# EasyEDA Pro project 轮足机器人主板&核心板.epro, schematic 主板原理图
Board Name: 主板; Create Date: 2024-11-16; Page Name: P1; Project Name: 轮足机器人; Schematic Name: 主板原理图; Update Date: 2024-11-25; Company: 嘉立创EDA; Drawed: YienMaster; Page Size: A4; Version: V1.0
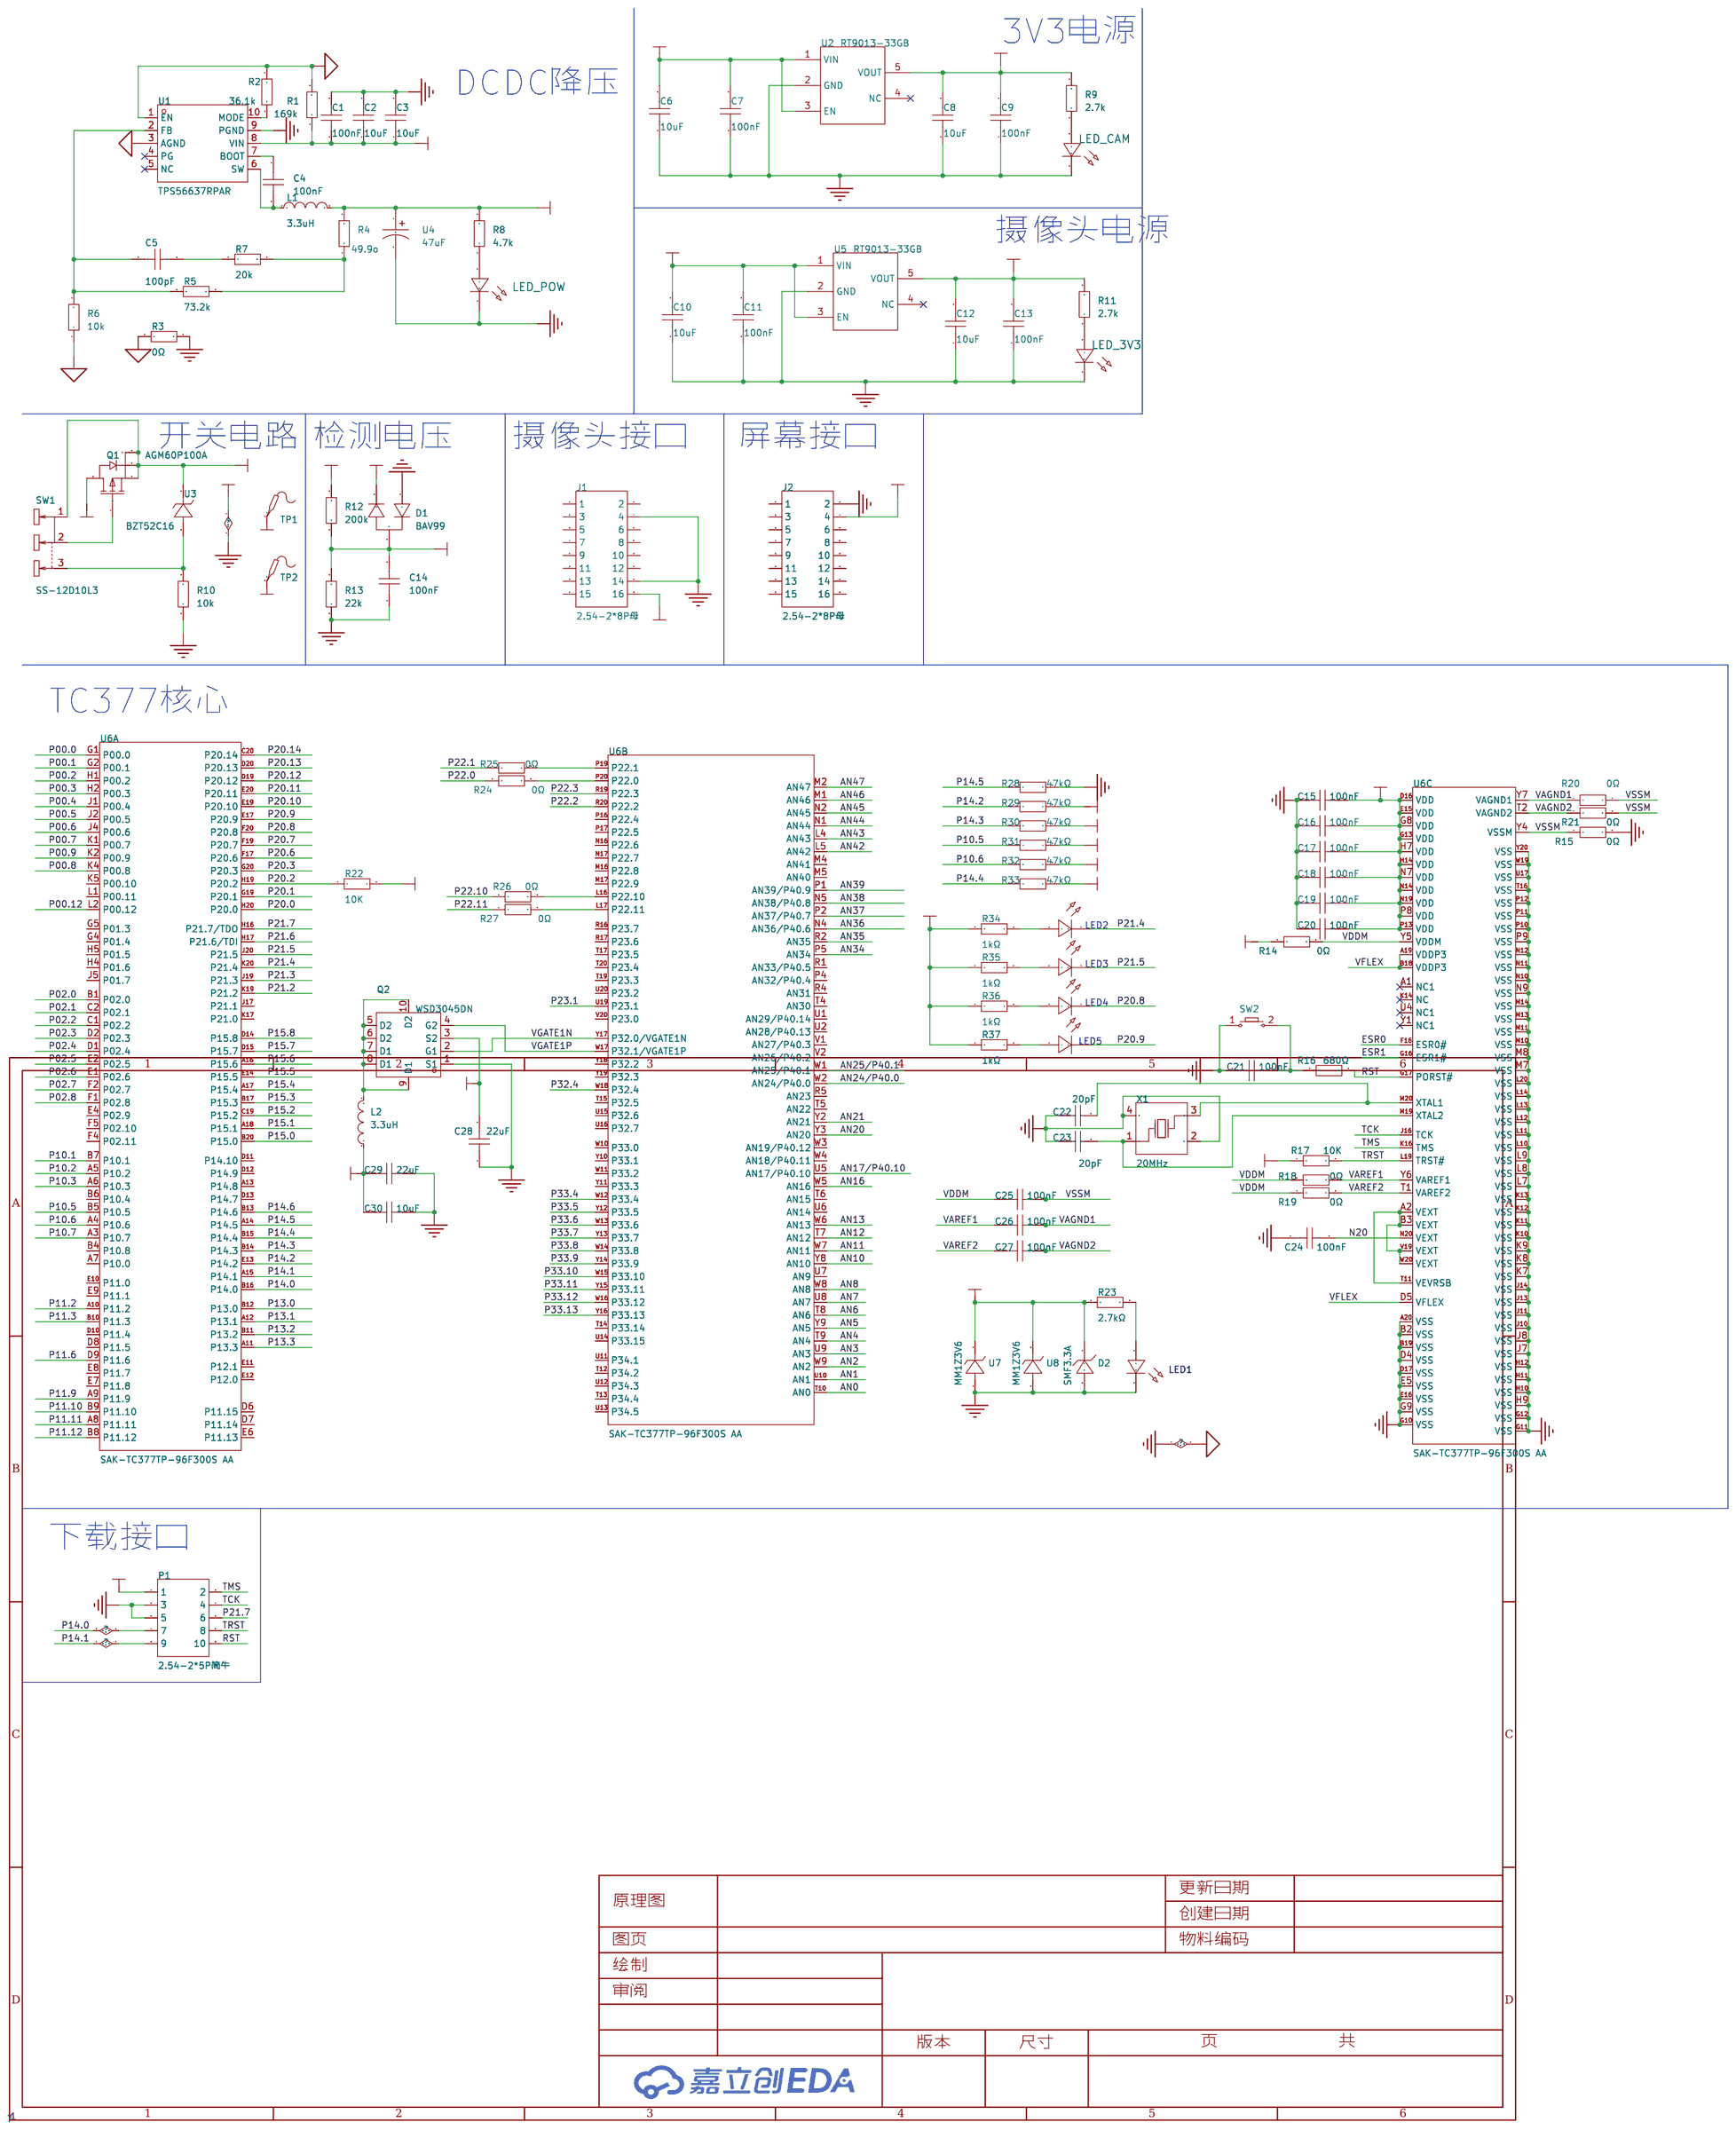
[diagram p1: schematic sheet]

## Parts
C1  100nF  [C0603]
C2  10uF  [C1206]
C3  10uF  [C1206]
C4  100nF  [C0603]
C5  100pF  [C0603]
C6  10uF  [C1206]
C7  100nF  [C0603]
C8  10uF  [C1206]
C9  100nF  [C0603]
C10  10uF  [C1206]
C11  100nF  [C0603]
C12  10uF  [C1206]
C13  100nF  [C0603]
C14  100nF  [C0603]
C15  100nF  [C0603]
C16  100nF  [C0603]
C17  100nF  [C0603]
C18  100nF  [C0603]
C19  100nF  [C0603]
C20  100nF  [C0603]
C21  100nF  [C0603]
C22  20pF  [C0603]
C23  20pF  [C0603]
C24  100nF  [C0603]
C25  100nF  [C0603]
C26  100nF  [C0603]
C27  100nF  [C0603]
C28  22uF  [C0603]
C29  22uF  [C0603]
C30  10uF  [C1206]
D1  BAV99  [SOT-23_L2.9-W1.3-P1.90-LS2.4-BR]
D2  SMF3.3A  [SOD-123_L2.8-W1.8-LS3.7-RD]
J1  2.54-2*8P母  [HDR-TH_16P-P2.54-V-F-R2-C8-S2.54]
J2  2.54-2*8P母  [HDR-TH_16P-P2.54-V-F-R2-C8-S2.54]
L1  3.3uH  [IND-SMD_L7.0-W6.6]
L2  3.3uH  [IND-SMD_L4.4-W4.2-A]
LED1  -  [LED_0603]
LED2  -  [LED_0603]
LED3  -  [LED_0603]
LED4  -  [LED_0603]
LED5  -  [LED_0603]
LED_3V3  -  [LED_0603]
LED_CAM  -  [LED_0603]
LED_POW  -  [LED_0603]
P1  2.54-2*5P简牛  [IDC-TH_10P-P2.54_C5665]
Q1  AGM60P100A  [TDSON-8_L5.9-W5.2-P1.27-BL]
Q2  WSD3045DN  [DFN-8_L3.2-W3.2-P0.65-LS3.4-BL-EP]
R1  169k  [R0603]
R2  36.1k  [R0603]
R3  0Ω  [R0603]
R4  49.9o  [R0603]
R5  73.2k  [R0603]
R6  10k  [R0603]
R7  20k  [R0603]
R8  4.7k  [R0603]
R9  2.7k  [R0603]
R10  10k  [R0603]
R11  2.7k  [R0603]
R12  200k  [R0603]
R13  22k  [R0603]
R14  0Ω  [R0603]
R15  0Ω  [R0603]
R16  680Ω  [R0603]
R17  10K  [R0603]
R18  0Ω  [R0603]
R19  0Ω  [R0603]
R20  0Ω  [R0603]
R21  0Ω  [R0603]
R22  10K  [R0603]
R23  2.7kΩ  [R0603]
R24  0Ω  [R0603]
R25  0Ω  [R0603]
R26  0Ω  [R0603]
R27  0Ω  [R0603]
R28  47kΩ  [R0603]
R29  47kΩ  [R0603]
R30  47kΩ  [R0603]
R31  47kΩ  [R0603]
R32  47kΩ  [R0603]
R33  47kΩ  [R0603]
R34  1kΩ  [R0603]
R35  1kΩ  [R0603]
R36  1kΩ  [R0603]
R37  1kΩ  [R0603]
SW1  SS-12D10L3  [SW-TH_SS-12D10L3]
SW2  -  [Key_SMD_3x4x2]
TP1  -  [Test-Point-0.5mm]
TP2  -  [Test-Point-0.5mm]
U1  TPS56637RPAR  [VQFN-HR-10_L3.0-W3.0_RPA]
U2  RT9013-33GB  [SOT-23-5_L3.0-W1.7-P0.95-LS2.8-BL]
U3  BZT52C16  [SOD-123_L2.7-W1.6-LS3.8-RD]
U4  47uF  [CAP-SMD_BD6.3-L6.6-W6.6-LS7.2-FD]
U5  RT9013-33GB  [SOT-23-5_L3.0-W1.7-P0.95-LS2.8-BL]
U6  SAK-TC377TP-96F300S AA  [PG-LFBGA-292_L17.0-W17.0-BL_SAK-TC1791F]  (sections 1,2,3)
U7  MM1Z3V6  [SOD-123_L2.7-W1.6-LS3.7-RD]
U8  MM1Z3V6  [SOD-123_L2.7-W1.6-LS3.7-RD]
X1  20MHz  [CRYSTAL-SMD_4P-L3.2-W2.5-BL-2]

## Library data of the parts
C1 C4 C7 C9 C11 C13 = CC0603KRX7R9BB104: 容值:100nF;精度:±10%;额定电压:50V;材质(温度系数):X7R;; LCSC Part Name: 100nF ±10% 50V; Supplier Part: C14663; Manufacturer: YAGEO(国巨); Supplier Footprint: 0603; JLCPCB Part Class: 基础库; Datasheet: https://atta.szlcsc.com/upload/public/pdf/source/20180910/C282072_33301C7F631E79921B82A8DAC6BCC5B3.pdf; Supplier: LCSC; Tolerance: ±10%; Voltage Rated: 50V; Temperature Coefficient: X7R
C2 C3 C6 C8 C10 C12 C30 = HGC1206R5106K500NSPJ: 容值:10uF;精度:±10%;额定电压:50V;材质(温度系数):X5R;; LCSC Part Name: 10uF ±10% 50V; Supplier Part: C7432781; Manufacturer: Chinocera(华瓷); Supplier Footprint: 1206; JLCPCB Part Class: 扩展库; Datasheet: https://atta.szlcsc.com/upload/public/pdf/source/20240320/FAC3FEC40A78BC5CCCE96C232A94D860.pdf; Supplier: LCSC; Tolerance: ±10%; Voltage Rated: 50V; Temperature Coefficient: X5R
C5 C14-C21 C24-C27 = CAP_0603: Supplier Footprint: 0603
C22 C23 = CL10C200JB8NNNC: 容值:20pF;精度:±5%;额定电压:50V;材质(温度系数):C0G;; LCSC Part Name: 20pF ±5% 50V; Supplier Part: C1648; Manufacturer: SAMSUNG(三星); Supplier Footprint: 0603; JLCPCB Part Class: 基础库; Datasheet: https://atta.szlcsc.com/upload/public/pdf/source/20160218/1457707763339.pdf; Supplier: LCSC; Tolerance: ±5%; Voltage Rated: 50V; Temperature Coefficient: C0G
C28 C29 = CGA0603X5R226M160JT: 容值:22uF;精度:±20%;额定电压:16V;材质(温度系数):X5R;; LCSC Part Name: 22uF ±20% 16V; Supplier Part: C6119868; Manufacturer: HRE(芯声); Supplier Footprint: 0603; JLCPCB Part Class: 扩展库; Supplier: LCSC; Tolerance: ±20%; Voltage Rated: 16V; Temperature Coefficient: X5R
D1 = BAV99_C408392: 二极管配置:1对串联式;正向压降(Vf):1.25V@150mA;直流反向耐压(Vr):70V;整流电流:200mA;反向恢复时间(trr):6ns;; LCSC Part Name: 电压:70V 电流:200mA; Supplier Part: C408392; Manufacturer: MDD(辰达半导体); Supplier Footprint: SOT-23; JLCPCB Part Class: 扩展库; Datasheet: https://atta.szlcsc.com/upload/public/pdf/source/20240710/712A41600A6652723ABF2FD56C16FE3C.pdf; Supplier: LCSC; Diode Configuration: 1对串联式; Forward Voltage (Vf@If): 1.25V@150mA; Reverse Voltage (Vr): 70V; Rectified Current: 200mA; Reverse Leakage Current: 2.5uA@70V; Reverse Recovery Time (trr): 6ns
D2 = SMF3.3A_C283866: 反向截止电压(Vrwm):3.3V;最大钳位电压:8V;峰值脉冲电流(Ipp)@10/1000us:25A;击穿电压:5.2V;; Supplier Part: C283866; Manufacturer: DOWO(东沃); Supplier Footprint: SOD-123FL; JLCPCB Part Class: 扩展库; Datasheet: https://atta.szlcsc.com/upload/public/pdf/source/20240321/1BA336232F2D97E4B026619682DB80D3.pdf; Supplier: LCSC; Reverse Stand-Off Voltage (Vrwm): 3.3V; Maximum Clamping Voltage: 8V; Peak Pulse Current (Ipp)@10/1000us: 25A; Breakdown Voltage: 5.2V; Reverse Leakage Current (Ir): 600uA; Type: TVS
J1 J2 = 2.54-2*8P母: 插孔结构:2x8P;间距:2.54mm;行距:2.54mm;安装类型:直插;排数:双排;总孔位数:16P;塑高:-;触头材质:黄铜;触头镀层:-;; LCSC Part Name: 间距:2.54mm 2x8P 直插; Supplier Part: C30734; Manufacturer: BOOMELE(博穆精密); Supplier Footprint: 插件,P=2.54mm; JLCPCB Part Class: 扩展库; Datasheet: https://atta.szlcsc.com/upload/public/pdf/source/20230817/400B44B2F3F98035DBB6B63900A9163B.pdf; Supplier: LCSC; Holes Structure: 2x8P; Pitch: 2.54mm; Row Spacing: 2.54mm; Mounting Type: 直插; Number of Rows: 双排; Number of Holes: 16P; Contact Material: 黄铜
L1 = FXL0630-3R3-M: 电感值:3.3uH;精度:±20%;额定电流:8.5A;饱和电流(Isat):9.5A;类型:一体成型电感;; LCSC Part Name: 3.3uH ±20% 9.5A; Supplier Part: C167219; Manufacturer: cjiang(长江微电); Supplier Footprint: SMD,6.6x7mm; JLCPCB Part Class: 扩展库; Datasheet: https://atta.szlcsc.com/upload/public/pdf/source/20240426/3189EA8206330E2108542F9E34E540E7.pdf; Supplier: LCSC; Tolerance: ±20%; Rated Current: 8.5A; Saturation Current (Isat): 9.5A; DC Resistance (DCR): 22mΩ; Type: 一体成型电感
L2 = FXL0420-3R3-M: 电感值:3.3uH;精度:±20%;额定电流:3.3A;饱和电流(Isat):4A;类型:一体成型电感;; LCSC Part Name: 3.3uH ±20% 4A; Supplier Part: C167207; Manufacturer: cjiang(长江微电); Supplier Footprint: SMD,4.2x4.4mm; JLCPCB Part Class: 扩展库; Datasheet: https://atta.szlcsc.com/upload/public/pdf/source/20240426/3189EA8206330E2108542F9E34E540E7.pdf; Supplier: LCSC; Tolerance: ±20%; Rated Current: 3.3A; Saturation Current (Isat): 4A; DC Resistance (DCR): 87mΩ; Type: 一体成型电感
LED1-LED5 = LED_0603-B: Supplier Footprint: 0603
LED_3V3 LED_CAM LED_POW = LED_0603-R: Supplier Footprint: 0603
P1 = 2.54-2*5P简牛: 连接器类型:简牛座;间距:2.54mm;结构:2x5P;封装形式:直插;行距:2.54mm;排数:2;每排PIN数:5;触头材质:-;触头镀层:-;; LCSC Part Name: 2.54mm 2x5P 排数:2 每排P数:5; Supplier Part: C5665; Manufacturer: BOOMELE(博穆精密); Supplier Footprint: 插件,P=2.54mm; JLCPCB Part Class: 扩展库; Datasheet: https://atta.szlcsc.com/upload/public/pdf/source/20140331/1457707037896.pdf; Supplier: LCSC; Connector Type: 简牛座; Pitch: 2.54mm; Structure: 2x5P; Holder Type: 直插; Row Spacing: 2.54mm; Number of Rows: 2; Pin Number in each Row: 5
Q1 = AGM60P100A: 类型:1个P沟道;漏源电压(Vdss):60V;连续漏极电流(Id):100A;导通电阻(RDS(on)@Vgs,Id):5.5mΩ@10V,15A;功率(Pd):150W;阈值电压(Vgs(th)@Id):2V@250uA;; LCSC Part Name: 1个P沟道 耐压:60V 电流:100A; Supplier Part: C5373096; Manufacturer: AGM-Semi(芯控源); Supplier Footprint: PDFN-8(5x6); JLCPCB Part Class: 扩展库; Datasheet: https://atta.szlcsc.com/upload/public/pdf/source/20241108/A068B77F4A82E836D758702AA2819D88.pdf; Supplier: LCSC; Type: 1个P沟道; Drain Source Voltage (Vdss): 60V; Continuous Drain Current (Id): 100A; Drain Source On Resistance (RDS(on)@Vgs,Id): 5.5mΩ@10V,15A; Power Dissipation (Pd): 150W; Gate Threshold Voltage (Vgs(th)@Id): 2V@250uA; Total Gate Charge (Qg@Vgs): 56nC@10V; Operating Temperature: -55℃~+150℃@(Tj)
Q2 = WSD3045DN: 类型:1个N沟道+1个P沟道;漏源电压(Vdss):30V;连续漏极电流(Id):-;功率(Pd):2.1W;导通电阻(RDS(on)@Vgs,Id):8.5mΩ@10V,6A;阈值电压(Vgs(th)@Id):1.8V@250uA;; LCSC Part Name: 1个N沟道+1个P沟道 耐压:30V; Supplier Part: C377868; Manufacturer: WINSOK(微硕); Supplier Footprint: DFN-8(3.2x3.2); JLCPCB Part Class: 扩展库; Datasheet: https://atta.szlcsc.com/upload/public/pdf/source/20190312/C377868_13BC188A8426F3DD2812D138E1771E36.pdf; Supplier: LCSC; Type: 1个N沟道+1个P沟道; Drain Source Voltage (Vdss): 30V; Power Dissipation (Pd): 2.1W; Drain Source On Resistance (RDS(on)@Vgs,Id): 8.5mΩ@10V,6A; Gate Threshold Voltage (Vgs(th)@Id): 1.8V@250uA; Total Gate Charge (Qg@Vgs): 2.7nC@4.5V; Input Capacitance (Ciss@Vds): 250pF@25V; Reverse Transfer Capacitance (Crss@Vds): 30pF@25V; Operating Temperature: -55℃~+150℃@(Tj)
R1 R2 R4-R13 R17 R22 = Res_0603: Supplier Footprint: 0603
R3 R14 R15 R18-R21 R24-R27 = 0603WAF0000T5E: 电阻类型:厚膜电阻;阻值:0Ω;精度:±1%;功率:100mW;最大工作电压:75V;; LCSC Part Name: 0Ω ±1% 100mW 厚膜电阻; Supplier Part: C21189; Manufacturer: UNI-ROYAL(厚声); Supplier Footprint: 0603; JLCPCB Part Class: 基础库; Datasheet: https://atta.szlcsc.com/upload/public/pdf/source/20200306/C422600_1E6D84923E4A46A82E41ADD87F860B5C.pdf; Supplier: LCSC; Type: 厚膜电阻; Tolerance: ±1%; Power(Watts): 100mW; Overload Voltage (Max): 75V; Operating Temperature Range: -55℃~+155℃
R16 = 0603WAF6800T5E: 电阻类型:厚膜电阻;阻值:680Ω;精度:±1%;功率:100mW;最大工作电压:75V;温度系数:±100ppm/℃;; LCSC Part Name: 680Ω ±1% 100mW 厚膜电阻; Supplier Part: C23228; Manufacturer: UNI-ROYAL(厚声); Supplier Footprint: 0603; JLCPCB Part Class: 基础库; Datasheet: https://atta.szlcsc.com/upload/public/pdf/source/20200306/C422600_1E6D84923E4A46A82E41ADD87F860B5C.pdf; Supplier: LCSC; Type: 厚膜电阻; Tolerance: ±1%; Power(Watts): 100mW; Overload Voltage (Max): 75V; Temperature Coefficient: ±100ppm/℃; Operating Temperature Range: -55℃~+155℃
R23 = 0603WAF2701T5E: 电阻类型:厚膜电阻;阻值:2.7kΩ;精度:±1%;功率:100mW;最大工作电压:75V;温度系数:±100ppm/℃;; LCSC Part Name: 2.7kΩ ±1% 100mW 厚膜电阻; Supplier Part: C13167; Manufacturer: UNI-ROYAL(厚声); Supplier Footprint: 0603; JLCPCB Part Class: 基础库; Datasheet: https://atta.szlcsc.com/upload/public/pdf/source/20200306/C422600_1E6D84923E4A46A82E41ADD87F860B5C.pdf; Supplier: LCSC; Type: 厚膜电阻; Tolerance: ±1%; Power(Watts): 100mW; Overload Voltage (Max): 75V; Temperature Coefficient: ±100ppm/℃; Operating Temperature Range: -55℃~+155℃
R28-R33 = 0603WAF4702T5E: 电阻类型:厚膜电阻;阻值:47kΩ;精度:±1%;功率:100mW;最大工作电压:75V;温度系数:±100ppm/℃;; LCSC Part Name: 47kΩ ±1% 100mW 厚膜电阻; Supplier Part: C25819; Manufacturer: UNI-ROYAL(厚声); Supplier Footprint: 0603; JLCPCB Part Class: 基础库; Datasheet: https://atta.szlcsc.com/upload/public/pdf/source/20200306/C422600_1E6D84923E4A46A82E41ADD87F860B5C.pdf; Supplier: LCSC; Type: 厚膜电阻; Tolerance: ±1%; Power(Watts): 100mW; Overload Voltage (Max): 75V; Temperature Coefficient: ±100ppm/℃; Operating Temperature Range: -55℃~+155℃
R34-R37 = 0603WAF1001T5E: 电阻类型:厚膜电阻;阻值:1kΩ;精度:±1%;功率:100mW;最大工作电压:75V;温度系数:±100ppm/℃;; LCSC Part Name: 1kΩ ±1% 100mW 厚膜电阻; Supplier Part: C21190; Manufacturer: UNI-ROYAL(厚声); Supplier Footprint: 0603; JLCPCB Part Class: 基础库; Datasheet: https://atta.szlcsc.com/upload/public/pdf/source/20200306/C422600_1E6D84923E4A46A82E41ADD87F860B5C.pdf; Supplier: LCSC; Type: 厚膜电阻; Tolerance: ±1%; Power(Watts): 100mW; Overload Voltage (Max): 75V; Temperature Coefficient: ±100ppm/℃; Operating Temperature Range: -55℃~+155℃
SW1 = SS-12D10L3: 电路结构:单刀双掷;安装方式:直插;开关颜色:黑色;额定电流(DC):3A;额定电压(DC):125V;额定电流(AC):3A;额定电压(AC):125V;机械寿命:1万次;; LCSC Part Name: 柄长3mm 直插双档 滑动开关; Supplier Part: C319013; Manufacturer: XKB Connectivity(中国星坤); Supplier Footprint: 插件; JLCPCB Part Class: 扩展库; Datasheet: https://atta.szlcsc.com/upload/public/pdf/source/20211009/D6412F37AABE6F9459A6EE7FA4DAEADB.pdf; Supplier: LCSC; Circuit: 单刀双掷; Actuator Style: 矩形柱状; Pin Style: PC引脚; Switch Length: 13mm; Switch Width: 6.8mm; Switch Height: 6.4mm; Mounting Style: 直插; Actuator Color: 黑色; Current Rating (DC): 3A; Voltage Rating (DC): 125V; Current Rating (AC): 3A; Voltage Rating (AC): 125V; Mechanical Life: 1万次; Operating Temperature: -40℃~+85℃
SW2 = Key_SMD_3x4x2: Supplier Footprint: SMD
TP1 TP2 = Test-Point: Test Point 测试点
U1 = TPS56637RPAR: 功能类型:降压型;输出类型:可调;输入电压:4.5V~28V;输出电压:600mV~13V;输出电流(最大值):6A;; Supplier Part: C841386; Manufacturer: TI(德州仪器); Supplier Footprint: VQFN-10-HR(3x3); JLCPCB Part Class: 扩展库; Datasheet: https://www.ti.com/cn/lit/gpn/tps56637; Supplier: LCSC; Function: 降压型; Output Type: 可调; Input Voltage: 4.5V~28V; Output Voltage: 600mV~13V; Output Current (Max): 6A; Switching Frequency: 500kHz; Operating Temperature: -40℃~+150℃@(TJ); Synchronous Rectification: 是; Number of Outputs: 1; Topology: 降压式; Switch tube (built-in/external): 内置
U2 U5 = RT9013-33GB: 输出类型:固定;最大输入电压:5.5V;输出电压:3.3V;最大输出电流:500mA;电源纹波抑制比(PSRR):50dB@(10kHz);输出极性:正极;; LCSC Part Name: 输入5.5V 输出3.3V 500mA; Supplier Part: C47773; Manufacturer: RICHTEK(立锜); Supplier Footprint: SOT-23-5; JLCPCB Part Class: 扩展库; Datasheet: https://atta.szlcsc.com/upload/public/pdf/source/20150504/1457707282459.pdf; Supplier: LCSC; Output Type: 固定; Maximum Input Voltage: 5.5V; Output Voltage: 3.3V; MAX Output Current: 500mA; Power Supply Rejection Ratio (PSRR): 50dB@(10kHz); Dropout Voltage: 400mV@(500mA); standby current: 50uA; Operating Temperature: -40℃~+85℃; Output Polarity: 正极; Number of Outputs: 1
U3 = BZT52C16_C2903915: 二极管配置:独立式;稳压值(标称值):16V;稳压值(范围):15.3V~17.1V;功率(Pd):500mW;; Supplier Part: C2903915; Manufacturer: GOODWORK(固得沃克); Supplier Footprint: SOD-123; JLCPCB Part Class: 扩展库; Datasheet: https://atta.szlcsc.com/upload/public/pdf/source/20211009/D2D840BC467623069B519162AA0DC941.pdf; Supplier: LCSC; Diode Configuration: 独立式; Zener Voltage (Nom): 16V; Reverse Leakage Current (Ir): 100nA@11.2V; Zener Voltage (Range): 15.3V~17.1V; Power Dissipation: 500mW; Zener Impedance (Zzt): 40Ω
U4 = HV1V476M0605PZ: 容值:47uF;精度:±20%;额定电压:35V;; LCSC Part Name: 47uF ±20% 35V; Supplier Part: C5246552; Manufacturer: HONOR(荣誉); Supplier Footprint: SMD,D6.3xL5.8mm; JLCPCB Part Class: 扩展库; Datasheet: https://atta.szlcsc.com/upload/public/pdf/source/20221103/F889AFCC379E96C645A0A58E4BAC43B0.pdf; Supplier: LCSC; Tolerance: ±20%; Rated Voltage: 35V; φD: 6.3mm; L: 5mm; Operating Temperature: -55℃~+105℃
U6 = SAK-TC377TP-96F300S AA: Supplier Part: C538866; Manufacturer: Infineon(英飞凌); Supplier Footprint: LFBGA-292; JLCPCB Part Class: 扩展库; Datasheet: https://atta.szlcsc.com/upload/public/pdf/source/20230201/4817F3AB8052933065390DBFE5F4B895.pdf; Supplier: LCSC
U7 U8 = MM1Z3V6_C22379457: 二极管配置:独立式;稳压值(标称值):3.6V;稳压值(范围):3.4V~3.8V;功率(Pd):500mW;; Supplier Part: C22379457; Manufacturer: 宏迦橙; Supplier Footprint: SOD-123; JLCPCB Part Class: 扩展库; Datasheet: https://atta.szlcsc.com/upload/public/pdf/source/20240409/F951BD59469D21DC5C1B102046132536.pdf; Supplier: LCSC; Diode Configuration: 独立式; Zener Voltage (Nom): 3.6V; Reverse Leakage Current (Ir): 10uA@1V; Zener Voltage (Range): 3.4V~3.8V; Power Dissipation: 500mW; Zener Impedance (Zzt): 130Ω
X1 = X322520MSB4SI: 晶振类型:贴片晶振;频率:20MHz;常温频差:±10ppm;负载电容:20pF;频率稳定度:±20ppm;; LCSC Part Name: 20MHz ±10ppm 20pF; Supplier Part: C9004; Manufacturer: YXC(扬兴晶振); Supplier Footprint: SMD3225-4P; JLCPCB Part Class: Extended Part; Datasheet: https://atta.szlcsc.com/upload/public/pdf/source/20240329/19D5F850207469550BEB00D7DFEDBC7A.pdf; Supplier: LCSC; Type: 贴片晶振; Normal temperature Frequency Tolerance: ±10ppm; Load Capacitance: 20pF; Frequency Stability: ±20ppm; Operating Temperature: -40℃~+85℃

## Nets
AGND: C15.1 C16.1 C17.1 C18.1 C19.1 C20.1 C21.1 C22.1 C23.1 C24.1 C28.1 C29.1 C30.1 D2.2 LED1.1(C) P1.3 P1.5 Q2.1(S1) R1.2 R2.1 R3.1 R6.1 R15.2 R28.2 SW2.1 U1.1(EN) U1.3(AGND) U6.A20(VSS) U6.B2(VSS) U6.B19(VSS) U6.D4(VSS) U6.D17(VSS) U6.E5(VSS) U6.E16(VSS) U6.G9(VSS) U6.G10(VSS) U6.G11(VSS) U6.G12(VSS) U6.H9(VSS) U6.H10(VSS) U6.H11(VSS) U6.H12(VSS) U6.J7(VSS) U6.J8(VSS) U6.J10(VSS) U6.J11(VSS) U6.J13(VSS) U6.J14(VSS) U6.K7(VSS) U6.K8(VSS) U6.K9(VSS) U6.K10(VSS) U6.K11(VSS) U6.K12(VSS) U6.K13(VSS) U6.L7(VSS) U6.L8(VSS) U6.L9(VSS) U6.L10(VSS) U6.L11(VSS) U6.L12(VSS) U6.L13(VSS) U6.L14(VSS) U6.L20(VSS) U6.M7(VSS) U6.M8(VSS) U6.M10(VSS) U6.M11(VSS) U6.M13(VSS) U6.M14(VSS) U6.N9(VSS) U6.N10(VSS) U6.N11(VSS) U6.N12(VSS) U6.P9(VSS) U6.P10(VSS) U6.P11(VSS) U6.P12(VSS) U6.T16(VSS) U6.U17(VSS) U6.W19(VSS) U6.Y20(VSS) U7.2(A) U8.2(A) X1.2(GND) X1.4(GND)
VCC1V25: C15.2 C16.2 C17.2 C18.2 C19.2 C20.2 C29.2 C30.2 L2.1 U6.D16(VDD) U6.E15(VDD) U6.G8(VDD) U6.G13(VDD) U6.H7(VDD) U6.H14(VDD) U6.N7(VDD) U6.N14(VDD) U6.N19(VDD) U6.P8(VDD) U6.P13(VDD)
VCC3V3: C8.2 C9.2 C28.2 D1.2 D2.1 J2.4 P1.1 Q2.3(S2) R9.2 R14.1 R17.1 R22.2 R23.1 R29.2 R30.2 R31.2 R32.2 R33.2 R34.1 R35.1 R36.1 R37.1 U2.5(VOUT) U7.1(K) U8.1(K)
VCC5V: C6.2 C7.2 C10.2 C11.2 L1.2 R4.2 R8.2 U2.1(VIN) U2.3(EN) U4.1 U5.1(VIN) U5.3(EN)
VCCCAM: C12.2 C13.2 J1.16 R11.2 U5.5(VOUT)
VDDM: C25.1 R14.2 R18.1 R19.1 U6.Y5(VDDM)
VIN_BAT: C1.1 C2.1 C3.1 Q1.5(D) R1.1 R12.2 U1.8(VIN)
VSSM: C25.2 R15.1 R20.2 R21.2 U6.Y4(VSSM)
ADC_BAT: C14.2 D1.3 R12.1 R13.2
AN0: U6.T10(AN0)
AN1: U6.U10(AN1)
AN2: U6.W9(AN2)
AN3: U6.U9(AN3)
AN4: U6.T9(AN4)
AN5: U6.Y9(AN5)
AN6: U6.T8(AN6)
AN7: U6.U8(AN7)
AN8: U6.W8(AN8)
AN10: U6.Y8(AN10)
AN11: U6.W7(AN11)
AN12: U6.T7(AN12)
AN13: U6.W6(AN13)
AN16: U6.W5(AN16)
AN17/P40.10: U6.U5(AN17/P40.10)
AN20: U6.Y3(AN20)
AN21: U6.Y2(AN21)
AN24/P40.0: U6.W2(AN24/P40.0)
AN25/P40.1: U6.W1(AN25/P40.1)
AN34: U6.P5(AN34)
AN35: U6.R2(AN35)
AN36: U6.N4(AN36/P40.6)
AN37: U6.P2(AN37/P40.7)
AN38: U6.N5(AN38/P40.8)
AN39: U6.P1(AN39/P40.9)
AN42: U6.L5(AN42)
AN43: U6.L4(AN43)
AN44: U6.N1(AN44)
AN45: U6.N2(AN45)
AN46: U6.M1(AN46)
AN47: U6.M2(AN47)
DCIN: Q1.1(S) Q1.2(S) Q1.3(S) SW1.1 TP1.1 U3.1(K)
DCOUT: C1.2 C2.2 C3.2 C6.1 C7.1 C8.1 C9.1 C10.1 C11.1 C12.1 C13.1 C14.1 D1.1 J1.4 J1.14 J2.2 LED_3V3.1(C) LED_CAM.1(C) LED_POW.1(C) R3.2 R10.1 R13.1 TP2.1 U1.9(PGND) U2.2(GND) U4.2 U5.2(GND)
ESR0: U6.F16(ESR0#)
ESR1: U6.G16(ESR1#)
N20: C24.2 U6.N20(VEXT)
P00.0: U6.G1(P00.0)
P00.1: U6.G2(P00.1)
P00.2: U6.H1(P00.2)
P00.3: U6.H2(P00.3)
P00.4: U6.J1(P00.4)
P00.5: U6.J2(P00.5)
P00.6: U6.J4(P00.6)
P00.7: U6.K1(P00.7)
P00.8: U6.K4(P00.8)
P00.9: U6.K2(P00.9)
P00.12: U6.L2(P00.12)
P02.0: U6.B1(P02.0)
P02.1: U6.C2(P02.1)
P02.2: U6.C1(P02.2)
P02.3: U6.D2(P02.3)
P02.4: U6.D1(P02.4)
P02.5: U6.E2(P02.5)
P02.6: U6.E1(P02.6)
P02.7: U6.F2(P02.7)
P02.8: U6.F1(P02.8)
P10.1: U6.B7(P10.1)
P10.2: U6.A5(P10.2)
P10.3: U6.A6(P10.3)
P10.5: R31.1 U6.B5(P10.5)
P10.6: R32.1 U6.A4(P10.6)
P10.7: U6.A3(P10.7)
P11.2: U6.A10(P11.2)
P11.3: U6.B10(P11.3)
P11.6: U6.D9(P11.6)
P11.9: U6.A9(P11.9)
P11.10: U6.B9(P11.10)
P11.11: U6.A8(P11.11)
P11.12: U6.B8(P11.12)
P13.0: U6.B12(P13.0)
P13.1: U6.A12(P13.1)
P13.2: U6.B11(P13.2)
P13.3: U6.A11(P13.3)
P14.0: P1.7 U6.B16(P14.0)
P14.1: P1.9 U6.A15(P14.1)
P14.2: R29.1 U6.E13(P14.2)
P14.3: R30.1 U6.B14(P14.3)
P14.4: R33.1 U6.B15(P14.4)
P14.5: R28.1 U6.A14(P14.5)
P14.6: U6.B13(P14.6)
P15.0: U6.B20(P15.0)
P15.1: U6.A18(P15.1)
P15.2: U6.C19(P15.2)
P15.3: U6.B17(P15.3)
P15.4: U6.A17(P15.4)
P15.5: U6.E14(P15.5)
P15.6: U6.A16(P15.6)
P15.7: U6.D15(P15.7)
P15.8: U6.D14(P15.8)
P20.0: U6.H20(P20.0)
P20.1: U6.G19(P20.1)
P20.2: R22.1 U6.H19(P20.2)
P20.3: U6.G20(P20.3)
P20.6: U6.F17(P20.6)
P20.7: U6.F19(P20.7)
P20.8: LED4.1(C) U6.F20(P20.8)
P20.9: LED5.1(C) U6.E17(P20.9)
P20.10: U6.E19(P20.10)
P20.11: U6.E20(P20.11)
P20.12: U6.D19(P20.12)
P20.13: U6.D20(P20.13)
P20.14: U6.C20(P20.14)
P21.2: U6.K19(P21.2)
P21.3: U6.J19(P21.3)
P21.4: LED2.1(C) U6.K20(P21.4)
P21.5: LED3.1(C) U6.J20(P21.5)
P21.6: U6.H17(P21.6/TDI)
P21.7: P1.6 U6.H16(P21.7/TDO)
P22.0: R24.1
P22.1: R25.1
P22.2: U6.R20(P22.2)
P22.3: U6.R19(P22.3)
P22.10: R26.1
P22.11: R27.1
P23.1: U6.U19(P23.1)
P32.4: U6.W18(P32.4)
P33.4: U6.W12(P33.4)
P33.5: U6.Y12(P33.5)
P33.6: U6.W13(P33.6)
P33.7: U6.Y13(P33.7)
P33.8: U6.W14(P33.8)
P33.9: U6.Y14(P33.9)
P33.10: U6.W15(P33.10)
P33.11: U6.Y15(P33.11)
P33.12: U6.W16(P33.12)
P33.13: U6.Y16(P33.13)
RST: P1.10 R16.2 U6.G17(PORST#)
TCK: P1.4 U6.J16(TCK)
TMS: P1.2 U6.K16(TMS)
TRST: P1.8 R17.2 U6.L19(TRST#)
VAGND1: C26.2 R20.1 U6.Y7(VAGND1)
VAGND2: C27.2 R21.1 U6.T2(VAGND2)
VAREF1: C26.1 R18.2 U6.Y6(VAREF1)
VAREF2: C27.1 R19.2 U6.T1(VAREF2)
VFLEX: U6.A19(VDDP3) U6.B18(VDDP3) U6.D5(VFLEX)
VGATE1N: Q2.2(G1) U6.Y17(P32.0/VGATE1N)
VGATE1P: Q2.4(G2) U6.W17(P32.1/VGATE1P)
$1N490: R2.2 U1.10(MODE)
$1N818: C4.1 U1.7(BOOT)
$1N829: C4.2 L1.1 U1.6(SW)
$1N1100: R4.1 R5.1 R7.2
$1N1185: C5.1 R7.1
$1N1250: C5.2 R5.2 R6.2 U1.2(FB)
$1N1551: LED_POW.2(A) R8.1
$1N4643: LED_CAM.2(A) R9.1
$1N5386: Q1.4(G) SW1.2
$1N5451: R10.2 SW1.3 U3.2(A)
$1N6038: LED_3V3.2(A) R11.1
$1N12870: U6.A2(VEXT) U6.B3(VEXT) U6.T11(VEVRSB) U6.V19(VEXT) U6.W20(VEXT)
$1N13817: C21.2 R16.1 SW2.2
$1N14118: C23.2 U6.M19(XTAL2) X1.1(OSC1)
$1N14125: C22.2 U6.M20(XTAL1) X1.3(OSC2)
$1N16561: LED1.2(A) R23.2
$1N17342: R25.2 U6.P19(P22.1)
$1N17343: R24.2 U6.P20(P22.0)
$1N17352: R26.2 U6.L16(P22.10)
$1N17353: R27.2 U6.L17(P22.11)
$1N18672: LED2.2(A) R34.2
$1N18676: LED3.2(A) R35.2
$1N18681: LED4.2(A) R36.2
$1N18686: LED5.2(A) R37.2
$1N18939: L2.2 Q2.5(D2) Q2.6(D2) Q2.7(D1) Q2.8(D1) Q2.9(D1) Q2.10(D2)

Not connected (* = marked no-connect by the designer): J1 1 2 3 5 6 7 8 9 10 11 12 13 15; J2 1 3 5 6 7 8 9 10 11 12 13 14 15 16; U1 4(PG)* 5(NC)*; U2 4(NC)*; U5 4(NC)*; U6 A1(NC1)* A7(P10.0) A13(P14.8) B4(P10.8) B6(P10.4) D6(P11.15) D7(P11.14) D8(P11.5) D10(P11.4) D11(P14.10) D12(P14.9) D13(P14.7) E4(P02.9) E6(P11.13) E7(P11.8) E8(P11.7) E9(P11.1) E10(P11.0) E11(P12.1) E12(P12.0) F4(P02.11) F5(P02.10) G4(P01.4) G5(P01.3) H4(P01.6) H5(P01.5) J5(P01.7) J17(P21.1) K5(P00.10) K14(NC)* K17(P21.0) L1(P00.11) M4(AN41) M5(AN40) M16(P22.8) M17(P22.9) N16(P22.6) N17(P22.7) P4(AN32/P40.4) P16(P22.4) P17(P22.5) R1(AN33/P40.5) R4(AN31) R5(AN23) R16(P23.7) R17(P23.6) T4(AN30) T5(AN22) T6(AN15) T12(P34.2) T13(P34.4) T14(P33.14) T15(P32.5) T17(P23.5) T19(P23.3) T20(P23.4) U1(AN29/P40.14) U2(AN28/P40.13) U4(NC1)* U6(AN14) U7(AN9) U11(P34.1) U12(P34.3) U13(P34.5) U14(P33.15) U15(P32.6) U16(P32.7) U20(P23.2) V1(AN27/P40.3) V2(AN26/P40.2) V20(P23.0) W3(AN19/P40.12) W4(AN18/P40.11) W10(P33.0) W11(P33.2) Y1(NC1)* Y10(P33.1) Y11(P33.3) Y18(P32.2) Y19(P32.3)

## Notes on the sheet
- 3V3电源
- DCDC降压
- 摄像头电源
- 开关电路
- 检测电压
- 摄像头接口
- 屏幕接口
- TC377核心
- 下载接口
